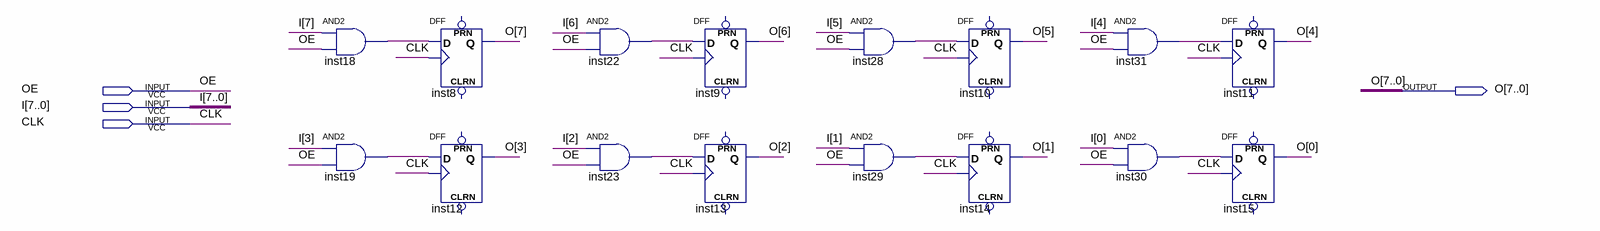
[diagram p0: schematic sheet]
// Quartus schematic dff8bit.bdf as structural Verilog: 16 symbols, 4 pins
module dff8bit (
  input  OE,
  input  [7:0] I,
  input  CLK,
  output [7:0] O
);

  wire inst18_out, inst19_out, inst22_out, inst23_out, inst28_out, inst29_out, inst30_out, inst31_out;

  and inst18 (inst18_out, I[7], OE);
  and inst19 (inst19_out, I[3], OE);
  DFF inst8 (.CLK(CLK), .D(inst18_out), .Q(O[7]));  // open: CLRN, PRN
  DFF inst12 (.CLK(CLK), .D(inst19_out), .Q(O[3]));  // open: CLRN, PRN
  and inst22 (inst22_out, I[6], OE);
  and inst23 (inst23_out, I[2], OE);
  DFF inst9 (.CLK(CLK), .D(inst22_out), .Q(O[6]));  // open: CLRN, PRN
  DFF inst13 (.CLK(CLK), .D(inst23_out), .Q(O[2]));  // open: CLRN, PRN
  and inst28 (inst28_out, I[5], OE);
  and inst29 (inst29_out, I[1], OE);
  DFF inst10 (.CLK(CLK), .D(inst28_out), .Q(O[5]));  // open: CLRN, PRN
  DFF inst14 (.CLK(CLK), .D(inst29_out), .Q(O[1]));  // open: CLRN, PRN
  and inst31 (inst31_out, I[4], OE);
  and inst30 (inst30_out, I[0], OE);
  DFF inst11 (.CLK(CLK), .D(inst31_out), .Q(O[4]));  // open: CLRN, PRN
  DFF inst15 (.CLK(CLK), .D(inst30_out), .Q(O[0]));  // open: CLRN, PRN
endmodule
